# Altium schematic sheet Shuttler_AFE.SchDoc: Shuttler AFE
size 420 x 297 mm; Author: G.Kasprowicz; CompanyName: WUT ISE; DrawnBy: G.Kasprowicz; Organization: WUT ISE; Address1: PW ISE; Address2: Nowowiejska 15/19 00-665 Warsaw; Address3: gkasprow@gmail.com; DocumentNumber: 1; SheetNumber: 1; SheetTotal: 6; ModifiedBy: -; CheckedDate: -; Title2: TOP; DivGrp: WUT ISE; Designer: G.Kasprowicz; ModifiedDate: -; ProjectName: Sensor Box
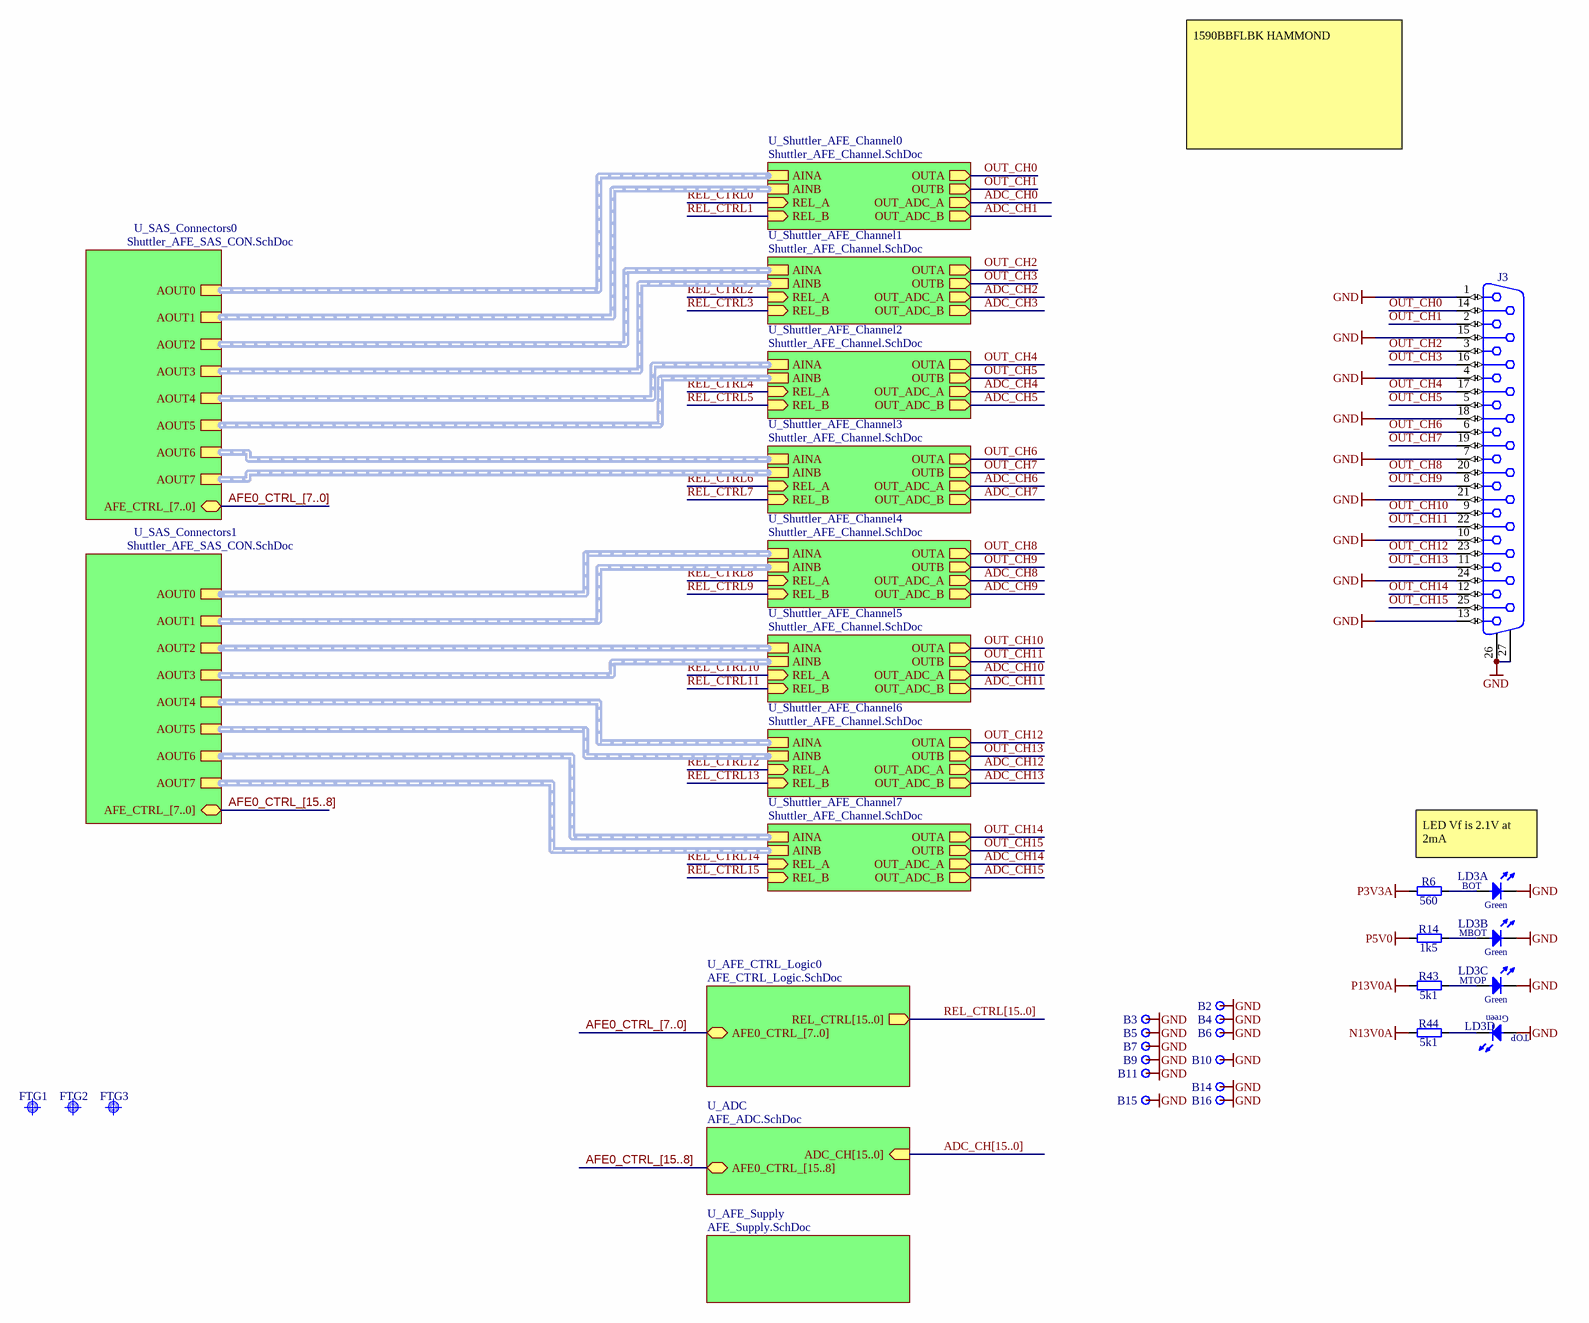
[diagram p0: Shuttler_AFE.SchDoc]

## Parts
B2  Plated Hole  [MTG270_500]  (value not drawn)  (no BOM)
B3  Plated Hole  [MTG270_500]  (value not drawn)  (no BOM)
B4  Plated Hole  [MTG270_500]  (value not drawn)  (no BOM)
B5  Plated Hole  [MTG270_500]  (value not drawn)  (no BOM)
B6  Plated Hole  [MTG270_500]  (value not drawn)  (no BOM)
B7  Plated Hole  [MTG270_500]  (value not drawn)  (no BOM)
B9  Plated Hole  [MTG270_500]  (value not drawn)  (no BOM)
B10  Plated Hole  [MTG270_500]  (value not drawn)  (no BOM)
B11  Plated Hole  [MTG270_500]  (value not drawn)  (no BOM)
B14  Plated Hole  [MTG270_500]  (value not drawn)  (no BOM)
B15  Plated Hole  [MTG270_500]  (value not drawn)  (no BOM)
B16  Plated Hole  [MTG270_500]  (value not drawn)  (no BOM)
FTG1  Use only in PCB  [FIDUCIAL_TOP_S100-200]  (value not drawn)
FTG2  Use only in PCB  [FIDUCIAL_TOP_S100-200]  (value not drawn)
FTG3  Use only in PCB  [FIDUCIAL_TOP_S100-200]  (value not drawn)
J3  D-Sub  [TYCO_3-1634586-2]  (value not drawn)
LD3  Green  [LED_BIVAR_H485CGDL]  (value not drawn)  (parts A,B,C,D of 4)
R6  560  [RESC1608X55N]
R14  1k5  [RESC1608X55N]
R43  5k1  [RESC1608X55N]
R44  5k1  [RESC1608X55N]

## Sub-sheets
U_ADC = AFE_ADC.SchDoc: ADC_CH[15..0] (in), AFE0_CTRL_[15..8] (bidir)
U_AFE_CTRL_Logic0 = AFE_CTRL_Logic.SchDoc: REL_CTRL[15..0] (out), AFE0_CTRL_[7..0] (bidir)
U_AFE_Supply = AFE_Supply.SchDoc: no entries
U_SAS_Connectors0 = Shuttler_AFE_SAS_CON.SchDoc: AOUT4 (harness DIFF), AOUT0 (harness DIFF), AOUT1 (harness DIFF), AOUT2 (harness DIFF), AOUT6 (harness DIFF), AOUT7 (harness DIFF), AFE_CTRL_[7..0] (bidir), AOUT3 (harness DIFF), AOUT5 (harness DIFF)
U_SAS_Connectors1 = Shuttler_AFE_SAS_CON.SchDoc: AOUT4 (harness DIFF), AOUT0 (harness DIFF), AOUT1 (harness DIFF), AOUT2 (harness DIFF), AOUT6 (harness DIFF), AOUT7 (harness DIFF), AFE_CTRL_[7..0] (bidir), AOUT3 (harness DIFF), AOUT5 (harness DIFF)
U_Shuttler_AFE_Channel0 = Shuttler_AFE_Channel.SchDoc: AINA (harness DIFF), OUTA (out), AINB (harness DIFF), OUTB (out), REL_A (in), REL_B (in), OUT_ADC_A (out), OUT_ADC_B (out)
U_Shuttler_AFE_Channel1 = Shuttler_AFE_Channel.SchDoc: AINA (harness DIFF), OUTA (out), AINB (harness DIFF), OUTB (out), REL_A (in), REL_B (in), OUT_ADC_A (out), OUT_ADC_B (out)
U_Shuttler_AFE_Channel2 = Shuttler_AFE_Channel.SchDoc: AINA (harness DIFF), OUTA (out), AINB (harness DIFF), OUTB (out), REL_A (in), REL_B (in), OUT_ADC_A (out), OUT_ADC_B (out)
U_Shuttler_AFE_Channel3 = Shuttler_AFE_Channel.SchDoc: AINA (harness DIFF), OUTA (out), AINB (harness DIFF), OUTB (out), REL_A (in), REL_B (in), OUT_ADC_A (out), OUT_ADC_B (out)
U_Shuttler_AFE_Channel4 = Shuttler_AFE_Channel.SchDoc: AINA (harness DIFF), OUTA (out), AINB (harness DIFF), OUTB (out), REL_A (in), REL_B (in), OUT_ADC_A (out), OUT_ADC_B (out)
U_Shuttler_AFE_Channel5 = Shuttler_AFE_Channel.SchDoc: AINA (harness DIFF), OUTA (out), AINB (harness DIFF), OUTB (out), REL_A (in), REL_B (in), OUT_ADC_A (out), OUT_ADC_B (out)
U_Shuttler_AFE_Channel6 = Shuttler_AFE_Channel.SchDoc: AINA (harness DIFF), OUTA (out), AINB (harness DIFF), OUTB (out), REL_A (in), REL_B (in), OUT_ADC_A (out), OUT_ADC_B (out)
U_Shuttler_AFE_Channel7 = Shuttler_AFE_Channel.SchDoc: AINA (harness DIFF), OUTA (out), AINB (harness DIFF), OUTB (out), REL_A (in), REL_B (in), OUT_ADC_A (out), OUT_ADC_B (out)

## Nets
GND: B2.1 B3.1 B4.1 B5.1 B6.1 B7.1 B9.1 B10.1 B11.1 B14.1 B15.1 B16.1 J3.1 J3.4 J3.7 J3.10 J3.13 J3.15 J3.18 J3.21 J3.24 J3.26 J3.27 LD3.1(C) LD3.3(C) LD3.5(C) LD3.8(A)
N13V0A: R44.1
P3V3A: R6.1
P5V0: R14.1
P13V0A: R43.1
ADC_CH0: sheet U_Shuttler_AFE_Channel0/OUT_ADC_A
ADC_CH1: sheet U_Shuttler_AFE_Channel0/OUT_ADC_B
ADC_CH2: sheet U_Shuttler_AFE_Channel1/OUT_ADC_A
ADC_CH3: sheet U_Shuttler_AFE_Channel1/OUT_ADC_B
ADC_CH4: sheet U_Shuttler_AFE_Channel2/OUT_ADC_A
ADC_CH5: sheet U_Shuttler_AFE_Channel2/OUT_ADC_B
ADC_CH6: sheet U_Shuttler_AFE_Channel3/OUT_ADC_A
ADC_CH7: sheet U_Shuttler_AFE_Channel3/OUT_ADC_B
ADC_CH8: sheet U_Shuttler_AFE_Channel4/OUT_ADC_A
ADC_CH9: sheet U_Shuttler_AFE_Channel4/OUT_ADC_B
ADC_CH10: sheet U_Shuttler_AFE_Channel5/OUT_ADC_A
ADC_CH11: sheet U_Shuttler_AFE_Channel5/OUT_ADC_B
ADC_CH12: sheet U_Shuttler_AFE_Channel6/OUT_ADC_A
ADC_CH13: sheet U_Shuttler_AFE_Channel6/OUT_ADC_B
ADC_CH14: sheet U_Shuttler_AFE_Channel7/OUT_ADC_A
ADC_CH15: sheet U_Shuttler_AFE_Channel7/OUT_ADC_B
OUT_CH0: J3.14 ; sheet U_Shuttler_AFE_Channel0/OUTA
OUT_CH1: J3.2 ; sheet U_Shuttler_AFE_Channel0/OUTB
OUT_CH2: J3.3 ; sheet U_Shuttler_AFE_Channel1/OUTA
OUT_CH3: J3.16 ; sheet U_Shuttler_AFE_Channel1/OUTB
OUT_CH4: J3.17 ; sheet U_Shuttler_AFE_Channel2/OUTA
OUT_CH5: J3.5 ; sheet U_Shuttler_AFE_Channel2/OUTB
OUT_CH6: J3.6 ; sheet U_Shuttler_AFE_Channel3/OUTA
OUT_CH7: J3.19 ; sheet U_Shuttler_AFE_Channel3/OUTB
OUT_CH8: J3.20 ; sheet U_Shuttler_AFE_Channel4/OUTA
OUT_CH9: J3.8 ; sheet U_Shuttler_AFE_Channel4/OUTB
OUT_CH10: J3.9 ; sheet U_Shuttler_AFE_Channel5/OUTA
OUT_CH11: J3.22 ; sheet U_Shuttler_AFE_Channel5/OUTB
OUT_CH12: J3.23 ; sheet U_Shuttler_AFE_Channel6/OUTA
OUT_CH13: J3.11 ; sheet U_Shuttler_AFE_Channel6/OUTB
OUT_CH14: J3.12 ; sheet U_Shuttler_AFE_Channel7/OUTA
OUT_CH15: J3.25 ; sheet U_Shuttler_AFE_Channel7/OUTB
REL_CTRL0: sheet U_Shuttler_AFE_Channel0/REL_A
REL_CTRL1: sheet U_Shuttler_AFE_Channel0/REL_B
REL_CTRL2: sheet U_Shuttler_AFE_Channel1/REL_A
REL_CTRL3: sheet U_Shuttler_AFE_Channel1/REL_B
REL_CTRL4: sheet U_Shuttler_AFE_Channel2/REL_A
REL_CTRL5: sheet U_Shuttler_AFE_Channel2/REL_B
REL_CTRL6: sheet U_Shuttler_AFE_Channel3/REL_A
REL_CTRL7: sheet U_Shuttler_AFE_Channel3/REL_B
REL_CTRL8: sheet U_Shuttler_AFE_Channel4/REL_A
REL_CTRL9: sheet U_Shuttler_AFE_Channel4/REL_B
REL_CTRL10: sheet U_Shuttler_AFE_Channel5/REL_A
REL_CTRL11: sheet U_Shuttler_AFE_Channel5/REL_B
REL_CTRL12: sheet U_Shuttler_AFE_Channel6/REL_A
REL_CTRL13: sheet U_Shuttler_AFE_Channel6/REL_B
REL_CTRL14: sheet U_Shuttler_AFE_Channel7/REL_A
REL_CTRL15: sheet U_Shuttler_AFE_Channel7/REL_B
NetLD3_2: LD3.2(A) R6.2
NetLD3_4: LD3.4(A) R14.2
NetLD3_6: LD3.6(A) R43.2
NetLD3_7: LD3.7(C) R44.2

## Buses and harness runs
bus ADC_CH[15..0] = sheet U_ADC/ADC_CH[15..0]
bus AFE0_CTRL_[7..0] = sheet U_AFE_CTRL_Logic0/AFE0_CTRL_[7..0]
bus AFE0_CTRL_[7..0] = sheet U_SAS_Connectors0/AFE_CTRL_[7..0]
bus AFE0_CTRL_[15..8] = sheet U_ADC/AFE0_CTRL_[15..8]
bus AFE0_CTRL_[15..8] = sheet U_SAS_Connectors1/AFE_CTRL_[7..0]
bus REL_CTRL[15..0] = sheet U_AFE_CTRL_Logic0/REL_CTRL[15..0]
harness sheet U_SAS_Connectors0/AOUT0 = sheet U_Shuttler_AFE_Channel0/AINA
harness sheet U_SAS_Connectors0/AOUT1 = sheet U_Shuttler_AFE_Channel0/AINB
harness sheet U_SAS_Connectors0/AOUT2 = sheet U_Shuttler_AFE_Channel1/AINA
harness sheet U_SAS_Connectors0/AOUT3 = sheet U_Shuttler_AFE_Channel1/AINB
harness sheet U_SAS_Connectors0/AOUT4 = sheet U_Shuttler_AFE_Channel2/AINA
harness sheet U_SAS_Connectors0/AOUT5 = sheet U_Shuttler_AFE_Channel2/AINB
harness sheet U_SAS_Connectors0/AOUT6 = sheet U_Shuttler_AFE_Channel3/AINA
harness sheet U_SAS_Connectors0/AOUT7 = sheet U_Shuttler_AFE_Channel3/AINB
harness sheet U_SAS_Connectors1/AOUT0 = sheet U_Shuttler_AFE_Channel4/AINA
harness sheet U_SAS_Connectors1/AOUT1 = sheet U_Shuttler_AFE_Channel4/AINB
harness sheet U_SAS_Connectors1/AOUT2 = sheet U_Shuttler_AFE_Channel5/AINA
harness sheet U_SAS_Connectors1/AOUT3 = sheet U_Shuttler_AFE_Channel5/AINB
harness sheet U_SAS_Connectors1/AOUT4 = sheet U_Shuttler_AFE_Channel6/AINA
harness sheet U_SAS_Connectors1/AOUT5 = sheet U_Shuttler_AFE_Channel6/AINB
harness sheet U_SAS_Connectors1/AOUT6 = sheet U_Shuttler_AFE_Channel7/AINA
harness sheet U_SAS_Connectors1/AOUT7 = sheet U_Shuttler_AFE_Channel7/AINB

## Notes on the sheet
- 1590BBFLBK HAMMOND
- LED Vf is 2.1V at 2mA
- Project/Equipment
- Document
- Designer
- Drawn by
- Check.by
- Copyright WUT ISE 2018.
  This documentation describes Open Hardware and is licensed under the CERN OHL v.1.1. You may redistribute and modify this documentation under the terms of the CERN OHL v.1.1. (http://ohwr.org/CERNOHL). This documentation is distributed WITHOUT ANY EXPRESS OR IMPLIED WARRANTY, INCLUDING OF MERCHANTABILITY, SATISFACTORY QUALITY AND FITNESS FOR A PARTICULAR PURPOSE. Please see the CERN OHL v.1.1 for applicable conditions.
- Contact
- File
- Last Mod.
- Print Date
- Sheet
- Size
- A3
- of
- Rev
- (in symbol LED_BIVAR_H485CGDL, part A) BOT
- (in symbol LED_BIVAR_H485CGDL, part B) MBOT
- (in symbol LED_BIVAR_H485CGDL, part C) MTOP
- (in symbol LED_BIVAR_H485CGDL, part D) TOP

## Library data of the parts
B2-B7 B9-B11 B14-B16 = PLATED_HOLE2.7_PAD5.0: Single Terminal Socket; Part Description: Plated Through Hole: Hole Dia.=2.7mm Pad Dia.=5.0mm; Mounted: No; Part Number: PLATED_HOLE2.7_PAD5.0; Component Type: Standard (No BOM); Pin Count: 1; Family: Plated Hole; Socket: No; SMD: No; Sense: No; Status: None; ComponentHeight: 0mm; HelpURL: Undefined; Author: CERN DEM JMW; CreateDate: 27.09.2011; LatestRevisionDate: 27.09.2011; PackageDescription: Plated Through Hole: Hole Dia.=2.7mm Pad Dia.=5.0mm
FTG1-FTG3 = FIDUCIAL_TARGET_S100-200: Fiducial Target; Part Description: Square Fiducial Target, Top Layer, 1.0mm, Top Solder 2.0mm, Keepout =2.0mm; Mounted: No; Table: Pads; Part Number: FIDUCIAL_TARGET_S100-200; Component Kind: Standard (No BOM); Component Type: Standard (No BOM); Pin Count: 1; Family: Fiducial; Socket: No; SMD: Yes; Status: None; ComponentHeight: 0mm; Author: CERN DEM JLC; CreateDate: 9/2/2010; LatestRevisionDate: 4/4/2012; PackageDescription: Square Fiducial Target, Top Layer, 1.0mm, Top Solder 2.0mm, Keepout =2.0mm
J3 = TYCO_3-1634586-2: Connector D-sub 25 Female; Part Description: Right Angle 25 Female Contacts D-SUB Connector With Boardlock and 4-40 UNC Screwlocks; Manufacturer: TYCO ELECTRONICS; PressFit: No; Part Number: TYCO_3-1634586-2; Component Kind: Standard; Component Type: Standard; Pin Count: 27; Family: D-Sub; Mounted: Yes; Socket: No; SMD: No; Sense: No; Status: None; Manufacturer Part Number: 3-1634586-2; ComponentHeight: 13.57mm; HelpURL: \\cern.ch\dfs\Applications\Altium\Datasheets\TYCO_3-1634586-2.pdf; Author: CERN DEM JLC; CreateDate: 16.01.2013; LatestRevisionDate: 16.01.2013
LD3 = LED_BIVAR_H485CGDL: LED x4 Green 1C2A-BOT_3C4A_5C6A_7C8A-TOP; Part Description: Quad-Level 2mm Green LED, PCB Edge Mounting; Manufacturer: BIVAR; PressFit: No; Bonding: No; Part Number: LED_BIVAR_H485CGDL; Component Kind: Standard; Component Type: Standard; Color: Green; PackageDescription: Quad-Level 2mm Green, PCB Edge Mounting  BIVAR H485CHDL; Manufacturer Part Number: H485CGDL; Pin Count: 8; Mounted: Yes; Socket: No; SMD: No; Sense: No; ComponentHeight: 11.3mm; HelpURL: \\cern.ch\dfs\Applications\Altium\Datasheets\LED_BIVAR_H485CGDL.pdf; Author: CERN DEM JLC; CreateDate: 04.06.2012; LatestRevisionDate: 04.06.2012
R6 = R0603_560R_1%_0.1W_100PPM: Resistor - 1%; Part Description: General Purpose Thick Film Chip Resistor; Manufacturer: GENERIC; Manufacturer1 Part Number: NRC06F5600TRF; Power: 0.1W; TC: ±100ppm/°C; PressFit: No; Part Number: R0603_560R_1%_0.1W_100PPM; Component Kind: Standard; Component Type: Standard; Pin Count: 2; Value: 560; Status: Preferred; Tolerance: ±1%; Manufacturer Part Number: R0603_560R_1%_0.1W_100PPM; Case: 0603; Mounted: Yes; Sense: No; Socket: No; SMD: Yes; Manufacturer1 Example: NIC COMPONENT; Manufacturer1 ComponentHeight: 0.55mm; HelpURL: \\cern.ch\dfs\Applications\Altium\Datasheets\R0603_NIC_NRC.pdf; Author: CERN DEM JLC; CreateDate: 03.12.2007; LatestRevisionDate: 13.03.2008
R14 = R0603_1K5_1%_0.1W_100PPM: Resistor - 1%; Part Description: General Purpose Thick Film Chip Resistor; Manufacturer: GENERIC; Manufacturer1 Part Number: NRC06F1501TRF; Power: 0.1W; TC: ±100ppm/°C; PressFit: No; Part Number: R0603_1K5_1%_0.1W_100PPM; Component Kind: Standard; Component Type: Standard; Pin Count: 2; Value: 1k5; Status: Preferred; Tolerance: ±1%; Manufacturer Part Number: R0603_1K5_1%_0.1W_100PPM; Case: 0603; Mounted: Yes; Sense: No; Socket: No; SMD: Yes; Manufacturer1 Example: NIC COMPONENT; Manufacturer1 ComponentHeight: 0.55mm; HelpURL: \\cern.ch\dfs\Applications\Altium\Datasheets\R0603_NIC_NRC.pdf; Author: CERN DEM JLC; CreateDate: 03.12.2007; LatestRevisionDate: 13.03.2008
R43 R44 = R0603_5k1_1%_0.1W_100PPM: Resistor - 1%; Part Description: General Purpose Thick Film Chip Resistor; Manufacturer: GENERIC; Manufacturer1 Part Number: NRC06F5101TRF; Power: 0.1W; TC: ±100ppm/°C; PressFit: No; Part Number: R0603_5K1_1%_0.1W_100PPM; Component Kind: Standard; Component Type: Standard; Pin Count: 2; Value: 5k1; Status: Preferred; Tolerance: ±1%; Manufacturer Part Number: R0603_5K1_1%_0.1W_100PPM; Case: 0603; Mounted: Yes; Sense: No; Socket: No; SMD: Yes; Manufacturer1 Example: NIC COMPONENT; Manufacturer1 ComponentHeight: 0.55mm; HelpURL: \\cern.ch\dfs\Applications\Altium\Datasheets\R0603_NIC_NRC.pdf; Author: CERN DEM JLC; CreateDate: 03.12.2007; LatestRevisionDate: 13.03.2008